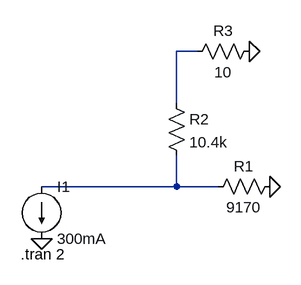
[diagram p0: schematic Current-divider.asc]
Current-divider.asc, the LTspice schematic file:
Version 4
SHEET 1 880 680
WIRE 288 -128 256 -128
WIRE 256 -48 256 -128
WIRE 256 80 256 32
WIRE 256 80 48 80
WIRE 320 80 256 80
FLAG 400 80 0
FLAG 48 160 0
FLAG 368 -128 0
SYMBOL current 48 80 R0
WINDOW 123 0 0 Left 0
WINDOW 39 0 0 Left 0
SYMATTR InstName I1
SYMATTR Value 300mA
SYMBOL res 240 -64 R0
SYMATTR InstName R2
SYMATTR Value 10.4k
SYMBOL res 416 64 R90
WINDOW 0 0 56 VBottom 2
WINDOW 3 32 56 VTop 2
SYMATTR InstName R1
SYMATTR Value 9170
SYMBOL res 384 -144 R90
WINDOW 0 0 56 VBottom 2
WINDOW 3 32 56 VTop 2
SYMATTR InstName R3
SYMATTR Value 10
TEXT 16 184 Left 2 !.tran 2

The netlist it stands for:
* Current-divider.asc
I1 N002 0 300mA
R2 N001 N002 10.4k
R1 0 N002 9170
R3 0 N001 10
.tran 2
.backanno
.end